# Altium schematic sheet 03_RFFE_diag.SchDoc: RF front end diagram
size A3; Organization: Lime Microsystems; Address1: Surrey Tech Centre; Address2: Guildford GU2 7YG; Address3: Surrey; Address4: United Kingdom; DocumentNumber: 2; Revision: v1.0; SheetNumber: 3; SheetTotal: 5
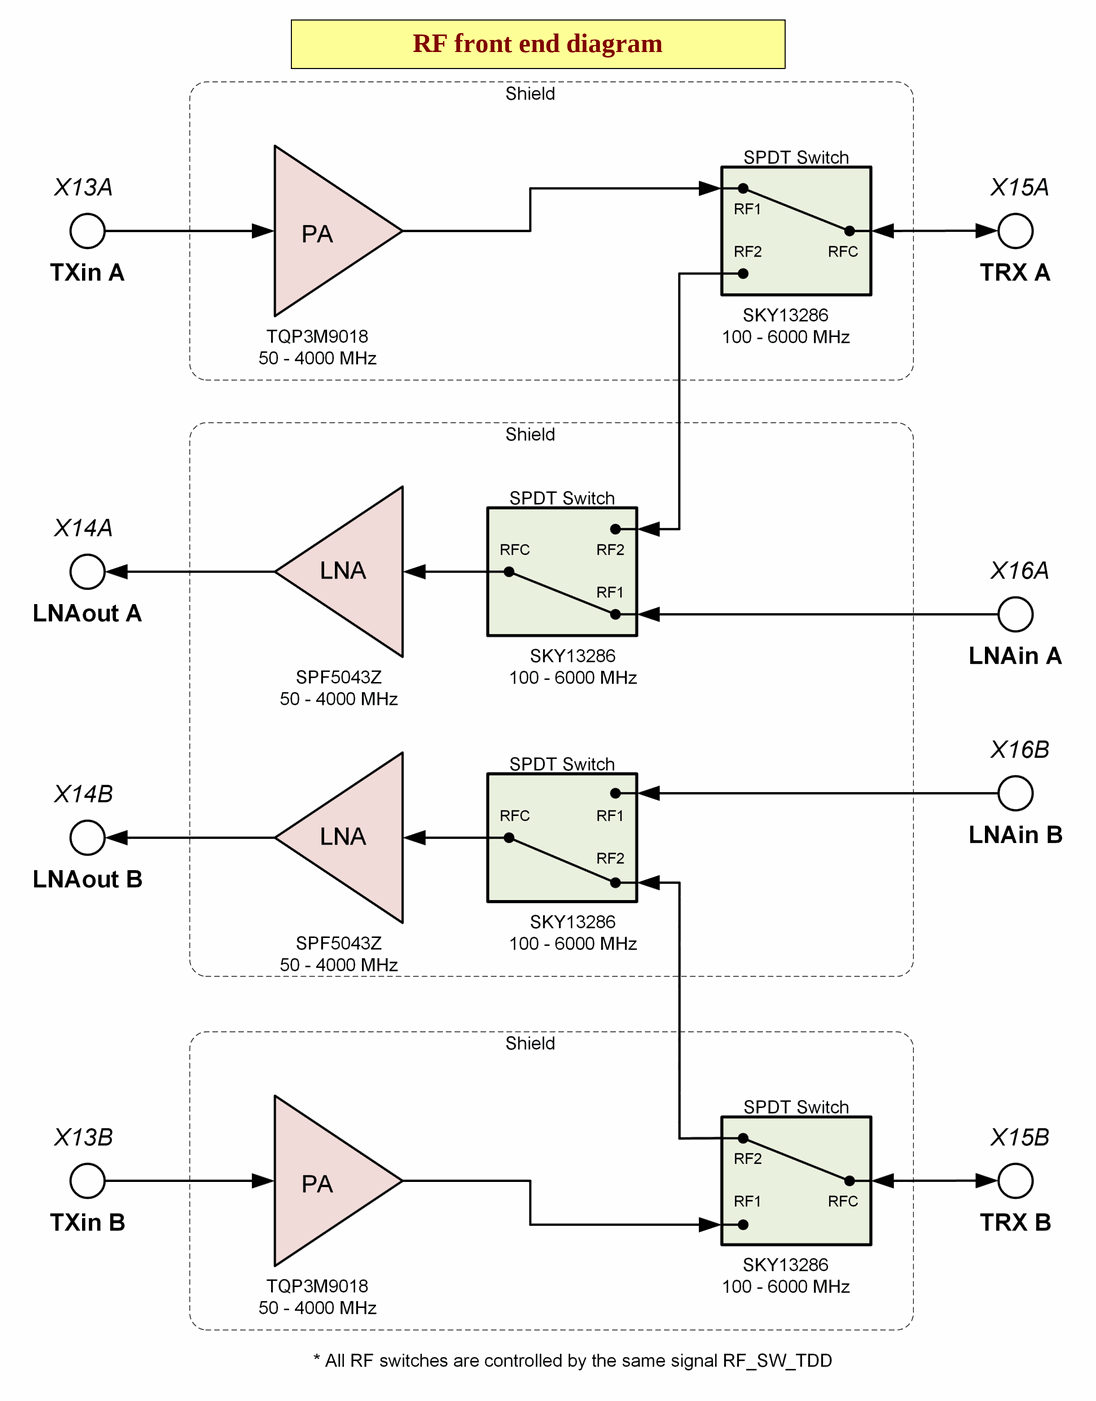
[diagram p0: 03_RFFE_diag.SchDoc]

## Notes on the sheet
- RF front end diagram
- Project name:
- Title:
- Size:
- Date:
- A3
- Revision:
- Time:
- Sheet
- of
- File: